# EAGLE design VW (EAGLE 9.6.2)
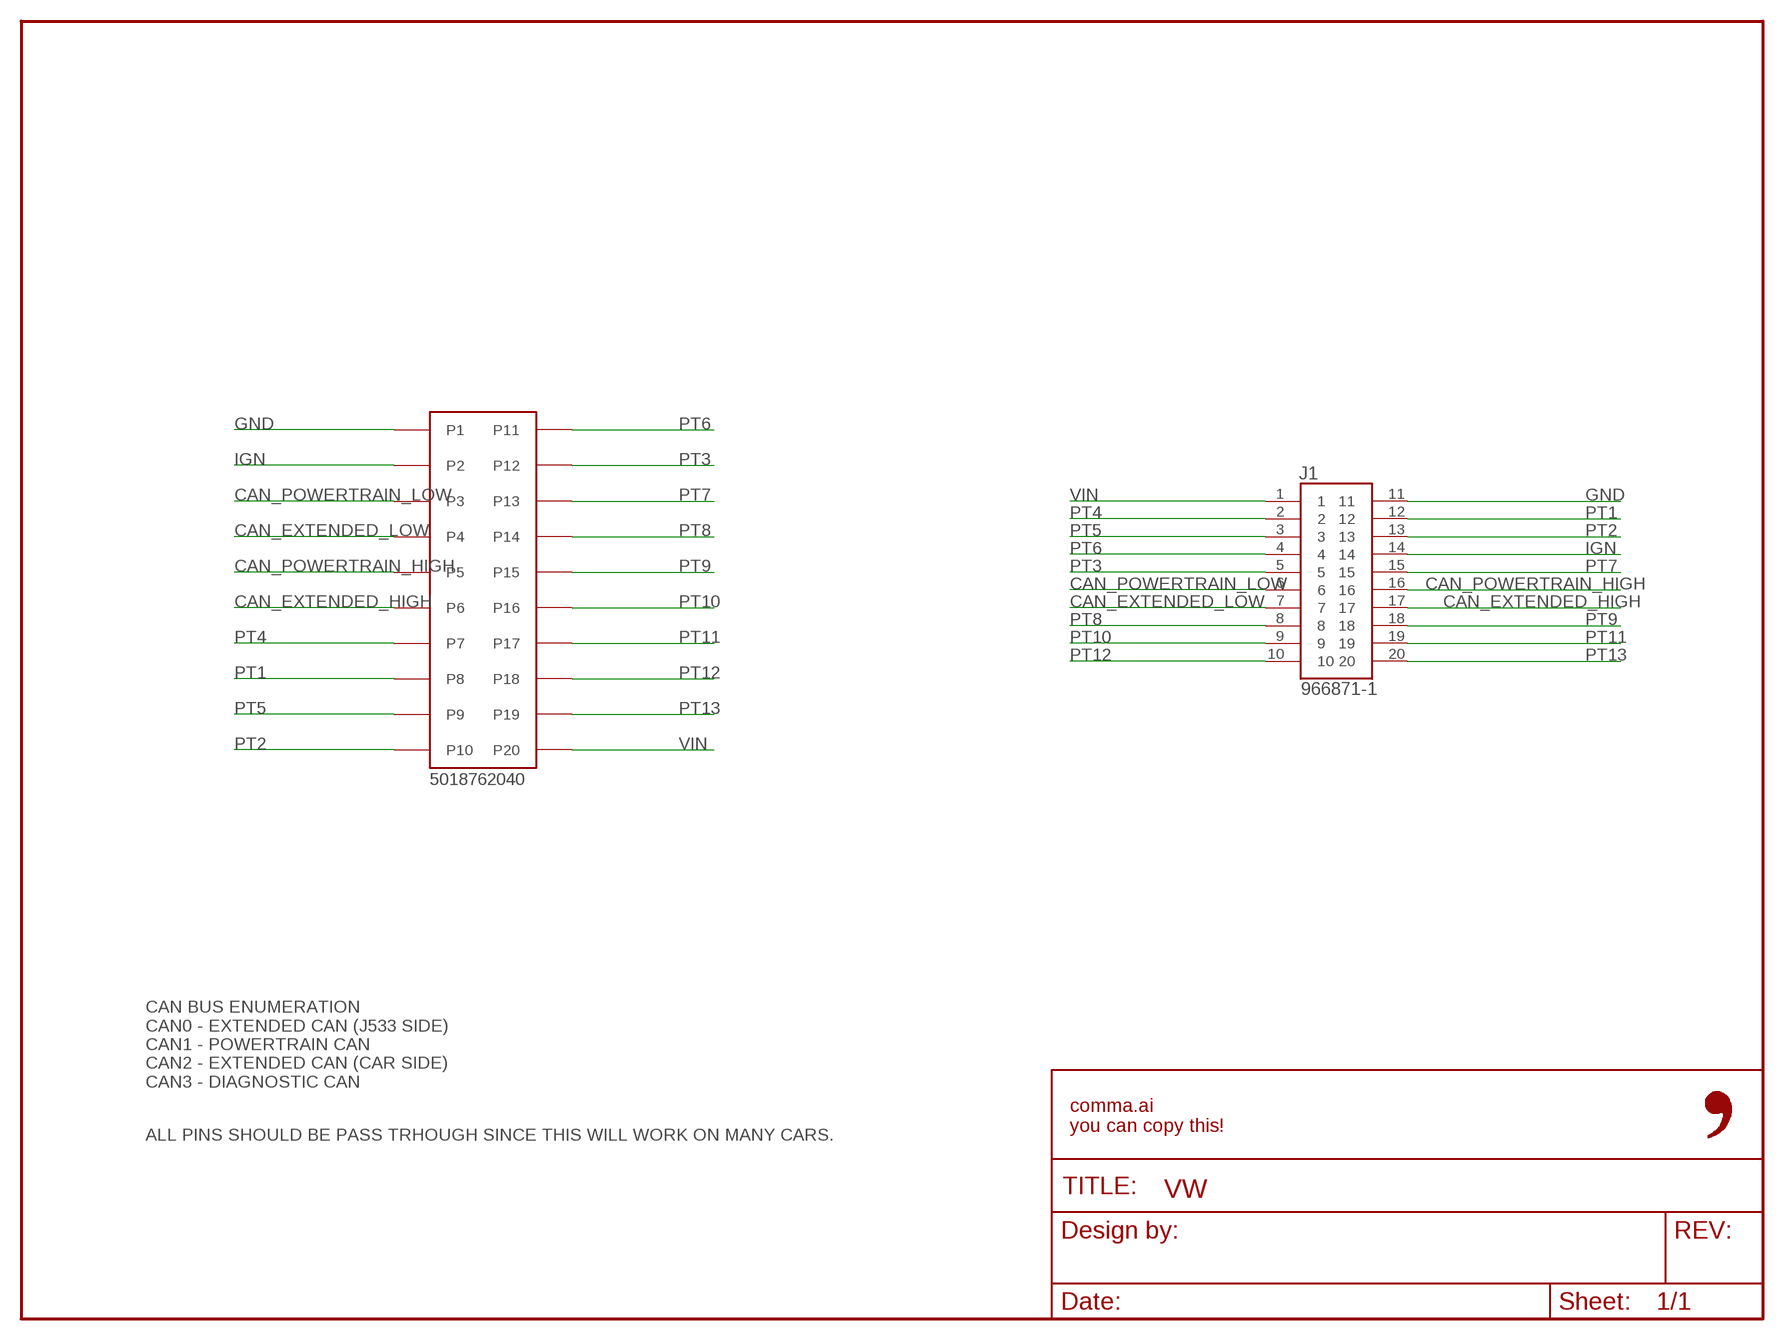
[diagram p0: schematic, sheet 1]

## Parts
FRAME1  FRAME-LETTER-OPENNO_PACKAGE  [DUMMY]
J1  966871-1  [TE_966871-1]
J2  5018762040  [5018762040]

## Nets
CAN_EXTENDED_HIGH: J1.17 J2.P6
CAN_EXTENDED_LOW: J1.7 J2.P4
CAN_POWERTRAIN_HIGH: J1.16 J2.P5
CAN_POWERTRAIN_LOW: J1.6 J2.P3
GND: J1.11 J2.P1
IGN: J1.14 J2.P2
PT1: J1.12 J2.P8
PT2: J1.13 J2.P10
PT3: J1.5 J2.P12
PT4: J1.2 J2.P7
PT5: J1.3 J2.P9
PT6: J1.4 J2.P11
PT7: J1.15 J2.P13
PT8: J1.8 J2.P14
PT9: J1.18 J2.P15
PT10: J1.9 J2.P16
PT11: J1.19 J2.P17
PT12: J1.10 J2.P18
PT13: J1.20 J2.P19
VIN: J1.1 J2.P20

## Notes on the sheet
- 5018762040
- CAN BUS ENUMERATION
  CAN0 - EXTENDED CAN (J533 SIDE)
  CAN1 - POWERTRAIN CAN
  CAN2 - EXTENDED CAN (CAR SIDE)
  CAN3 - DIAGNOSTIC CAN
- ALL PINS SHOULD BE PASS TRHOUGH SINCE THIS WILL WORK ON MANY CARS.

## Library data of the parts
FRAME1 = comma.ai:FRAME-LETTER-OPEN: Schematic Frame - Letter Standard 8.5x11 US Letter frame; DESIGNER: Nobody; VERSION: v01
J1 = 966871-1:966871-1: Conn Shrouded Header HDR 20 POS 2.5mm Solder RA Thru-Hole Automotive; COMMENT: 966871-1; CPN: CAI-HARNESS-TE-966871-1; DESCRIPTION: Conn Shrouded Header HDR 20 POS 2.5mm Solder RA Thru-Hole Automotive Tray; DIGI-KEY_PART_NUMBER: A119719-ND; EU_ROHS_COMPLIANCE: Compliant; MF: TE Connectivity; MP: 966871-1; MPN: 966871-1; PACKAGE: None; PURCHASE-URL: https://pricing.snapeda.com/search/part/966871-1/?ref=eda
J2 = 5018761440:5018762040; CPN: CAI-HARNESS-MOLEX-5018762040; MPN: 5018762040

## Board
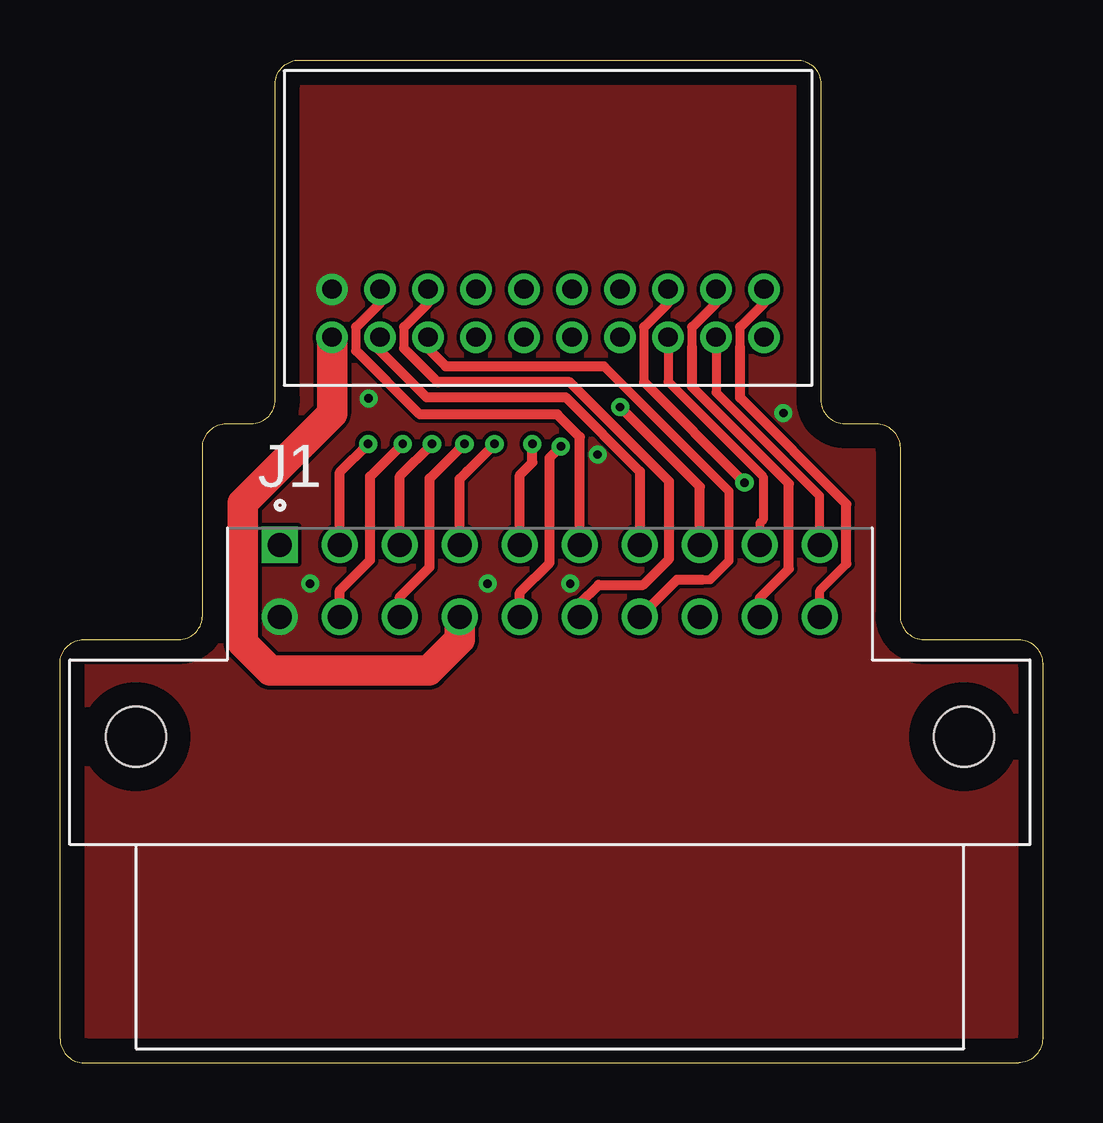
[diagram p1: board, top side]
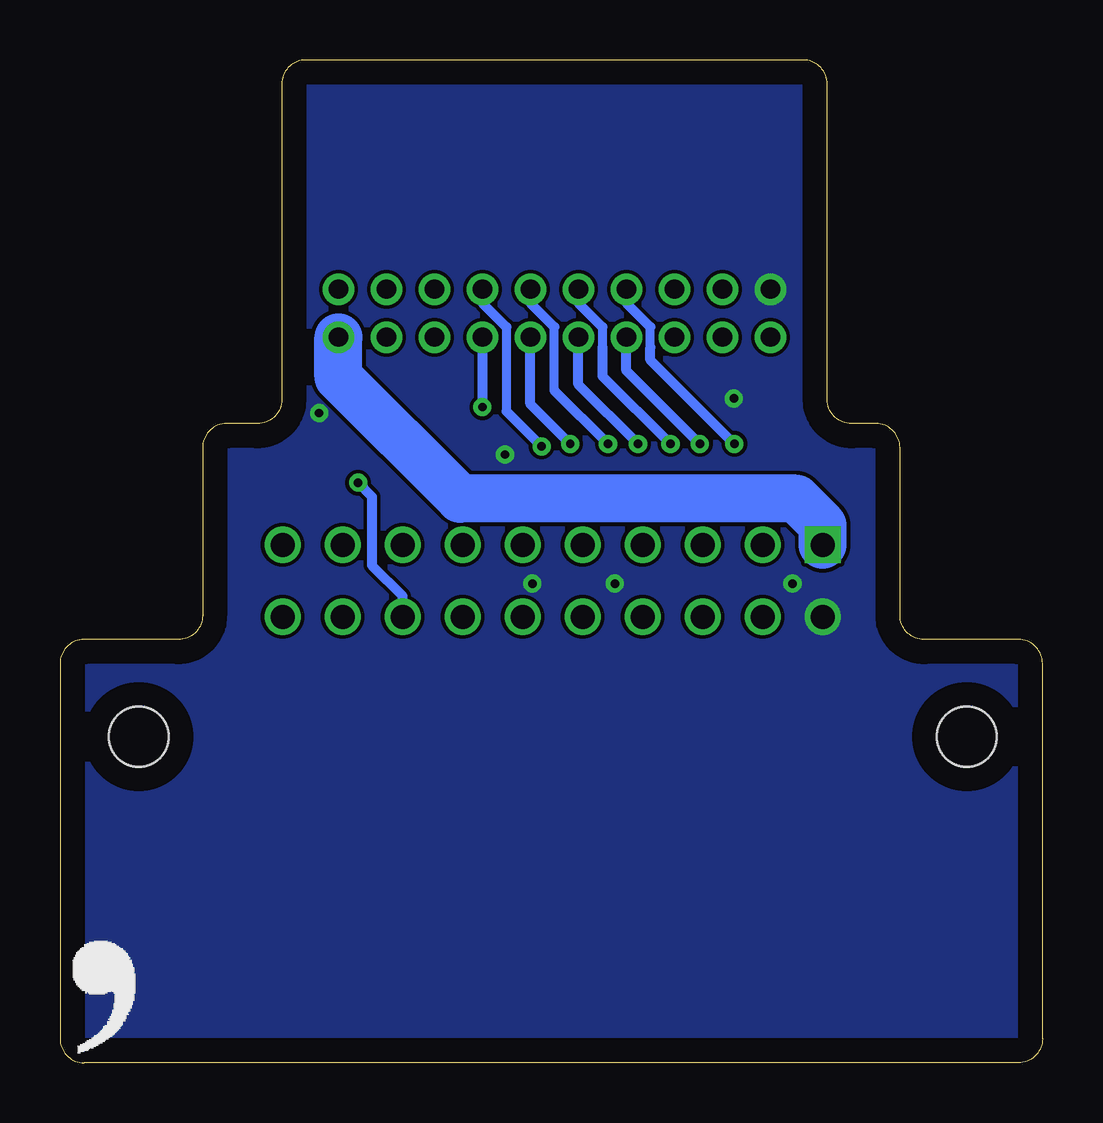
[diagram p2: board, bottom side, seen from below]

Size 40.94 x 41.8 mm. Coordinates in mm from the lower left corner, seen from the top.
Outline: 40.94,16.64 40.94,1 arc-90 39.94,0 1,0 arc-90 0,1 0,16.64 arc-90 1,17.64 4.94,17.64 arc90 5.94,18.64 5.94,25.64 arc-90 6.94,26.64 7.97,26.64 arc90 8.97,27.64 8.97,40.8 arc-90 9.97,41.8 30.7,41.8 arc-90 31.7,40.8 31.7,27.64 arc90 32.7,26.64 34,26.64 arc-90 35,25.64 35,18.64 arc90 36,17.64 39.94,17.64 arc-90 40.94,16.64
Copper layers (1*16): Top 0.035mm / dielectric 1.5mm / Bottom 0.035mm
Design rules "default": minimum track width 6mil, minimum drill 0.35mm, track to track 6mil, track to pad 6mil, pad to pad 6mil, via to via 6mil, smd to smd 6mil, copper to edge 40mil, drill to drill 6mil, minimum pad ring 10mil, minimum via ring 8mil, stop-mask expansion 4mil, vias tented up to drill 0mil, thermal gap 10mil

### Footprints (pad centres in the part's own frame; a part is rotated, then mirrored left to right if it is on the bottom)
TE_966871-1 = drill 1 square: 1 0,0 | drill 1: 2 2.5,0; 3 5,0; 4 7.5,0; 5 10,0; 6 12.5,0; 7 15,0; 8 17.5,0; 9 20,0; 10 22.5,0; 11 0,-3; 12 2.5,-3; 13 5,-3; 14 7.5,-3; 15 10,-3; 16 12.5,-3; 17 15,-3; 18 17.5,-3; 19 20,-3; 20 22.5,-3 | hole 2.5: -6,-8; 28.5,-8
5018762040 = drill 0.8: P1 9,-1; P2 9,1; P3 7,-1; P4 7,1; P5 5,-1; P6 5,1; P7 3,-1; P8 3,1; P9 1,-1; P10 1,1; P11 -1,-1; P12 -1,1; P13 -3,-1; P14 -3,1; P15 -5,-1; P16 -5,1; P17 -7,-1; P18 -7,1; P19 -9,-1; P20 -9,1

### Placement (x,y rotation side)
FRAME1  0.27,27.94 0 top
J1  9.16,21.59 0 top
J2  20.34,31.24 180 top
U$1  [LOGO]  41.08,0.1 0 bottom

### Tracks (layer width: path | path; a pad name or v marks a point on that pad's centre or on a via)
CAN_EXTENDED_HIGH
  Top 0.38: 26.75,20.14 27.09,20.14 27.88,20.93 27.88,23.82 22.66,29.04
  Top 0.406: J2.P6 15.34,29.76 16.06,29.04 22.66,29.04 | J1.17 25.71,20.14 26.75,20.14
CAN_EXTENDED_LOW
  Top 0.406: J2.P4 13.34,29.67 15.27,27.74 21.07,27.74 24.16,24.65 J1.7
CAN_POWERTRAIN_HIGH
  Top 0.38: 14.34,29.77 14.34,30.67
  Top 0.406: J2.P5 15.34,31.67 14.34,30.67 | J1.16 21.66,19.14 22.44,19.92 24.3,19.92 25.38,21 25.38,24.23 21.24,28.37 15.74,28.37 14.34,29.77
CAN_POWERTRAIN_LOW
  Top 0.38: 12.34,29.68 12.34,30.67
  Top 0.406: J1.6 21.66,26.09 20.73,27.02 15,27.02 12.34,29.68 | J2.P3 13.34,31.67 12.34,30.67
GND  (via drill 0.35)
  other vias: 17.82,19.97 12.86,27.69 22.4,25.35 21.26,19.97 10.42,19.97 30.14,27.08
  pour Top (no thermals): -1.03,43.64 -1.03,-1.36 43.97,-1.36 43.97,43.64
  pour Bottom (no thermals): -2.03,42.64 -2.03,-2.36 42.97,-2.36 42.97,42.64
IGN
  Top 1.27: J2.P2 11.34,27.06 7.61,23.34 7.61,17.49 8.75,16.35 15.37,16.35 16.66,17.64 J1.14
PT1  (via drill 0.35)
  Top 0.406: J1.12 11.66,19.69 12.92,20.95 12.92,24.44 v14.28,25.8 | v14.28,25.8
  Bottom 0.406: v14.28,25.8 17.34,28.85 J2.P8
PT2  (via drill 0.35)
  Top 0.406: J1.13 14.16,19.42 15.4,20.66 15.4,24.36 16.84,25.8 v16.86,25.8
  Bottom 0.406: v16.86,25.8 19.34,28.28 J2.P10
PT3  (via drill 0.35)
  Top 0.406: J1.5 19.16,24.51 19.68,25.03 v19.68,25.8
  Bottom 0.406: v19.68,25.8 21.34,27.45 J2.P12
PT4  (via drill 0.35)
  Top 0.406: J1.2 11.66,24.62 v12.84,25.8
  Bottom 0.38: 16.34,29.82 16.34,30.67
  Bottom 0.406: J2.P7 17.34,31.67 16.34,30.67 | v12.84,25.8 16.34,29.29 16.34,29.82
PT5  (via drill 0.35)
  Top 0.406: J1.3 14.16,24.46 v15.5,25.8
  Bottom 0.38: 18.34,30.67 18.34,29.82
  Bottom 0.406: J2.P9 19.34,31.67 18.34,30.67 | v15.5,25.8 18.34,28.63 18.34,29.82
PT6  (via drill 0.35)
  Top 0.406: J1.4 16.66,24.34 16.96,24.65 v18.11,25.79 v18.11,25.8
  Bottom 0.38: 20.34,28.03 20.34,30.67
  Bottom 0.406: v18.11,25.8 20.34,28.03 | J2.P11 21.34,31.67 20.34,30.67
PT7  (via drill 0.35)
  Top 0.406: J1.15 19.16,19.6 20.4,20.84 20.4,25.22 v20.87,25.69
  Bottom 0.38: 22.34,30.68 22.34,27.16
  Bottom 0.406: v20.87,25.69 22.34,27.16 | J2.P13 23.34,31.67 22.34,30.68
PT8  (via drill 0.35)
  Top 0.406: J1.8 26.66,24.01 v23.34,27.33
  Bottom 0.406: J2.P14 v23.34,27.33
PT9  (via drill 0.35)
  Top 0.38: 24.34,28.36 24.34,30.67
  Top 0.406: J2.P15 25.34,31.67 24.34,30.67 | v28.52,24.18 24.34,28.36
  Bottom 0.406: J1.18 26.66,19.45 27.94,20.73 27.94,23.6 v28.52,24.18
PT10
  Top 0.38: J2.P16 25.34,28.39 29.3,24.43 29.3,22.63 29.16,22.49 J1.9
PT11
  Top 0.38: 26.34,29.82 26.34,30.67
  Top 0.406: J2.P17 27.34,31.67 26.34,30.67 | J1.19 29.16,19.38 30.37,20.59 30.37,24.14 26.34,28.17 26.34,29.82
PT12
  Top 0.38: J2.P18 27.34,27.95 31.64,23.64 31.64,21.61 J1.10
PT13
  Top 0.38: J1.20 31.66,19.68 32.77,20.79 | 28.34,29.82 28.34,30.67
  Top 0.406: J2.P19 29.34,31.67 28.34,30.67 | 32.77,20.79 32.77,23.28 28.34,27.72 28.34,29.82
VIN
  Bottom 2: J1.1 9.16,22.41 10.26,23.51 24.27,23.51 29.34,28.58 J2.P20

### Text on the board
bDocu: J533 Harness / 3/5/21